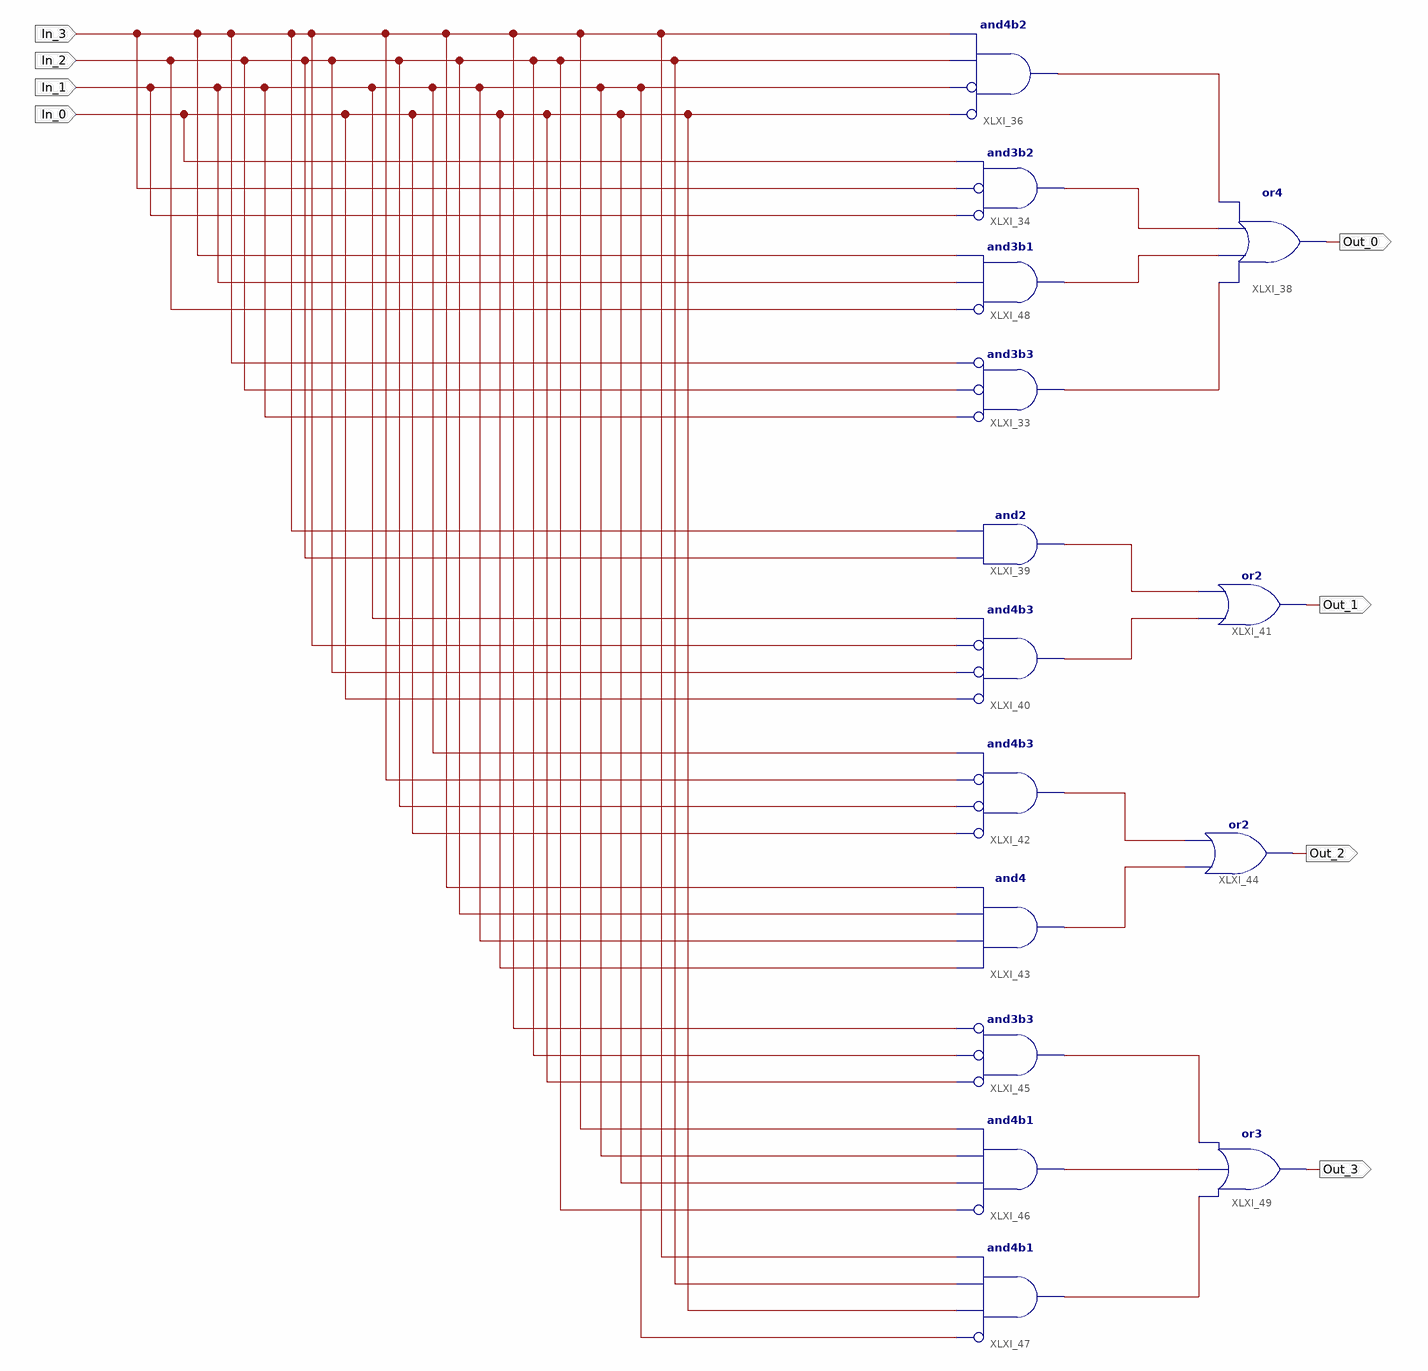
[diagram p0: schematic sheet 1]
// Xilinx ISE schematic My2To4Decoder.sch (spartan3a) as structural Verilog: 15 symbols, 8 ports
module My2To4Decoder (
  input  In_3,
  input  In_2,
  input  In_1,
  input  In_0,
  output Out_0,
  output Out_1,
  output Out_2,
  output Out_3
);

  wire XLXN_1, XLXN_2, XLXN_3, XLXN_4, XLXN_6, XLXN_7, XLXN_9, XLXN_10, XLXN_13, XLXN_14, XLXN_15;

  and XLXI_34 (XLXN_2, ~In_1, ~In_3, In_0);  // and3b2
  or XLXI_38 (Out_0, XLXN_4, XLXN_3, XLXN_2, XLXN_1);
  and XLXI_39 (XLXN_6, In_2, In_3);
  and XLXI_40 (XLXN_7, ~In_0, ~In_2, ~In_3, In_1);  // and4b3
  or XLXI_41 (Out_1, XLXN_7, XLXN_6);
  and XLXI_42 (XLXN_9, ~In_0, ~In_2, ~In_3, In_1);  // and4b3
  and XLXI_43 (XLXN_10, In_0, In_1, In_2, In_3);
  or XLXI_44 (Out_2, XLXN_10, XLXN_9);
  and XLXI_45 (XLXN_13, ~In_0, ~In_2, ~In_3);  // and3b3
  and XLXI_46 (XLXN_14, ~In_2, In_0, In_1, In_3);  // and4b1
  and XLXI_47 (XLXN_15, ~In_1, In_0, In_2, In_3);  // and4b1
  and XLXI_48 (XLXN_3, ~In_2, In_1, In_3);  // and3b1
  or XLXI_49 (Out_3, XLXN_15, XLXN_14, XLXN_13);
  and XLXI_33 (XLXN_4, ~In_1, ~In_2, ~In_3);  // and3b3
  and XLXI_36 (XLXN_1, ~In_0, ~In_1, In_2, In_3);  // and4b2
endmodule
